# Altium schematic sheet control.SchDoc (part 2 of 2)
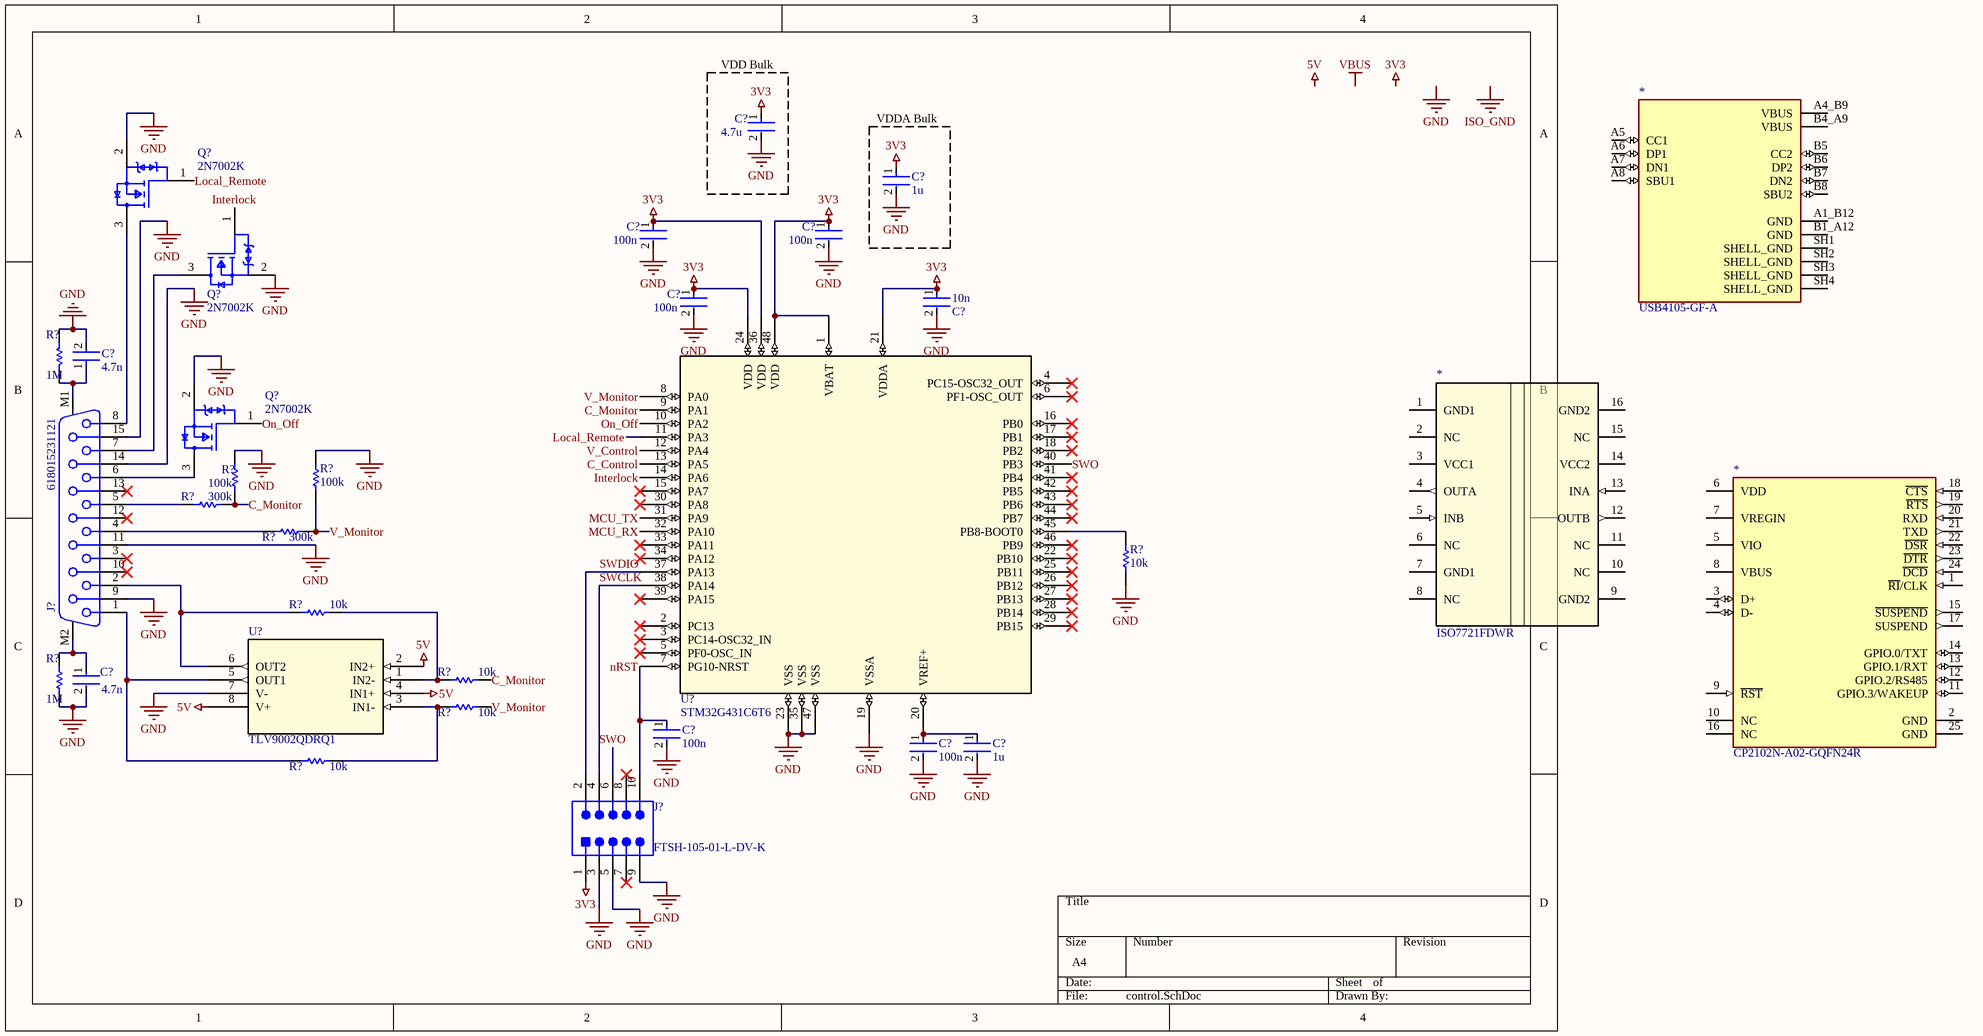
[diagram p1: control.SchDoc]

## Library data of the parts (continued)
Q?#1-Q?#3 = 2N7002K: Mosfet N-ch 60V 300MA SOT23 / Trans Mosfet N-ch 60V 0.3A 3-PIN SOT-23 T/r; Manufacturer: onsemi; Manufacturer Lifecycle Status: ACTIVE; Continuous Drain Current (ID): 115mA; Current: 3A; Drain to Source Resistance: 2Ω; Element Configuration: Single; Gate to Source Voltage (Vgs): 20V; Input Capacitance: 50pF; Max Junction Temperature (Tj): 150°C; Max Power Dissipation: 350W; Number of Channels: 1; Power Dissipation: 300mW; Value: 2Ω; Threshold Voltage: 2.5V; Turn-Off Delay Time: 55.8ns; Turn-On Delay Time: 12.2ns; Supplier: DigiKey; Supplier Part Number: 2N7002KCT-ND; Manufacturer Part Number: 2N7002K; RoHS: Compliant; Category: MOSFETs; Stock: 393574; Pricing: 1=0.33, 10=0.203, 100=0.1271, 500=0.09384, 1000=0.08309 (USD); Case/Package: SOT-23; China RoHS: Compliant; Contact Plating: Tin; Drain to Source Breakdown Voltage: 60V; Drain to Source Voltage (Vdss): 60V; Height: 1.11mm; Lead Free: Lead Free; Length: 2.92mm; Lifecycle Status: Production; Max Operating Temperature: 150°C; Min Breakdown Voltage: 60V; Min Operating Temperature: -55°C; Mounting Technology: Surface Mount; Number of Elements: 1; Pins: 3; Number of Terminals: 3; Radiation Hardening: No; Rds On Max: 2Ω; REACH SVHC: Yes; Schedule B: 8541210080, 8541210080|8541210080|8541210080|8541210080|8541210080; Voltage: 60V; Width: 1.3mm; ComponentLink1URL: https://datasheet.octopart.com:443/2N7002K-onsemi-datasheet-180957336.pdf?src-supplier=IHS; ComponentLink1Description: https://datasheet.octopart.com:443/2N7002K-onsemi-datasheet-180957336.pdf?src-supplier=IHS; ComponentLink2URL: https://datasheet.octopart.com:443/2N7002K-Fairchild-Semiconductor-datasheet-34208596.pdf?src-supplier=IHS; ComponentLink2Description: https://datasheet.octopart.com:443/2N7002K-Fairchild-Semiconductor-datasheet-34208596.pdf?src-supplier=IHS; ComponentLink3URL: https://datasheet.octopart.com:443/2N7002K-ON-Semiconductor-datasheet-138897972.pdf?src-supplier=onsemi; ComponentLink3Description: https://datasheet.octopart.com:443/2N7002K-ON-Semiconductor-datasheet-138897972.pdf?src-supplier=onsemi; ComponentLink4URL: https://datasheet.octopart.com:443/2N7002K-ON-Semiconductor-datasheet-147841327.pdf?src-supplier=onsemi; ComponentLink4Description: https://datasheet.octopart.com:443/2N7002K-ON-Semiconductor-datasheet-147841327.pdf?src-supplier=onsemi; ComponentLink5URL: https://datasheet.octopart.com:443/2N7002K-ON-Semiconductor-datasheet-81464098.pdf?src-supplier=onsemi; ComponentLink5Description: https://datasheet.octopart.com:443/2N7002K-ON-Semiconductor-datasheet-81464098.pdf?src-supplier=onsemi; ComponentLink6URL: https://datasheet.octopart.com:443/2N7002K-ON-Semiconductor-datasheet-8636720.pdf?src-supplier=onsemi; ComponentLink6Description: https://datasheet.octopart.com:443/2N7002K-ON-Semiconductor-datasheet-8636720.pdf?src-supplier=onsemi; ComponentLink7URL: https://sigma.octopart.com:443/138897241/technical_drawing/ON-Semiconductor-2N7002K.pdf?src-supplier=Upverter; ComponentLink7Description: https://sigma.octopart.com:443/138897241/technical_drawing/ON-Semiconductor-2N7002K.pdf?src-supplier=Upverter; ComponentLink8URL: https://datasheet.octopart.com:443/2N7002K-ON-Semiconductor-datasheet-13704821.pdf?src-supplier=element14+APAC; ComponentLink8Description: https://datasheet.octopart.com:443/2N7002K-ON-Semiconductor-datasheet-13704821.pdf?src-supplier=element14+APAC; ComponentLink9URL: https://datasheet.octopart.com:443/2N7002K-ON-Semiconductor-datasheet-86682065.pdf?src-supplier=element14+APAC; ComponentLink9Description: https://datasheet.octopart.com:443/2N7002K-ON-Semiconductor-datasheet-86682065.pdf?src-supplier=element14+APAC; ComponentLink10URL: https://datasheet.octopart.com:443/2N7002K-onsemi-datasheet-181958640.pdf?src-supplier=Newark; ComponentLink10Description: https://datasheet.octopart.com:443/2N7002K-onsemi-datasheet-181958640.pdf?src-supplier=Newark; ComponentLink11URL: https://datasheet.octopart.com:443/2N7002K-Fairchild-Semiconductor-datasheet-67650041.pdf?src-supplier=Newark; ComponentLink11Description: https://datasheet.octopart.com:443/2N7002K-Fairchild-Semiconductor-datasheet-67650041.pdf?src-supplier=Newark; ComponentLink12URL: https://datasheet.octopart.com:443/2N7002K-Fairchild-Semiconductor-datasheet-68365086.pdf?src-supplier=Newark; ComponentLink12Description: https://datasheet.octopart.com:443/2N7002K-Fairchild-Semiconductor-datasheet-68365086.pdf?src-supplier=Newark; ComponentLink13URL: https://datasheet.octopart.com:443/2N7002K-Fairchild-Semiconductor-datasheet-68558619.pdf?src-supplier=Newark; ComponentLink13Description: https://datasheet.octopart.com:443/2N7002K-Fairchild-Semiconductor-datasheet-68558619.pdf?src-supplier=Newark; ComponentLink14URL: https://datasheet.octopart.com:443/2N7002K-ON-Semiconductor-datasheet-137315652.pdf?src-supplier=Future+Electronics; ComponentLink14Description: https://datasheet.octopart.com:443/2N7002K-ON-Semiconductor-datasheet-137315652.pdf?src-supplier=Future+Electronics; ComponentLink15URL: https://sigma.octopart.com:443/17343971/technical_drawing/Fairchild-Semiconductor-2N7002K.pdf?src-supplier=Fairchild+Semiconductor; ComponentLink15Description: https://sigma.octopart.com:443/17343971/technical_drawing/Fairchild-Semiconductor-2N7002K.pdf?src-supplier=Fairchild+Semiconductor; ComponentLink16URL: https://datasheet.octopart.com:443/2N7002K-Fairchild-Semiconductor-datasheet-67878677.pdf?src-supplier=Farnell; ComponentLink16Description: https://datasheet.octopart.com:443/2N7002K-Fairchild-Semiconductor-datasheet-67878677.pdf?src-supplier=Farnell; ComponentLink17URL: https://datasheet.octopart.com:443/2N7002K-Fairchild-Semiconductor-datasheet-68650436.pdf?src-supplier=Farnell; ComponentLink17Description: https://datasheet.octopart.com:443/2N7002K-Fairchild-Semiconductor-datasheet-68650436.pdf?src-supplier=Farnell; ComponentLink18URL: https://datasheet.octopart.com:443/2N7002K-Fairchild-Semiconductor-datasheet-78857226.pdf?src-supplier=Farnell; ComponentLink18Description: https://datasheet.octopart.com:443/2N7002K-Fairchild-Semiconductor-datasheet-78857226.pdf?src-supplier=Farnell; ComponentLink19URL: http://sigma.octopart.com:80/150600003/rohs_statement/ON-Semiconductor-2N7002K.pdf?src-supplier=Compliance+Statements; ComponentLink19Description: http://sigma.octopart.com:80/150600003/rohs_statement/ON-Semiconductor-2N7002K.pdf?src-supplier=Compliance+Statements; ComponentLink20URL: http://sigma.octopart.com:80/17343977/reach_statement/Fairchild-Semiconductor-2N7002K.pdf?src-supplier=Compliance+Statements; ComponentLink20Description: http://sigma.octopart.com:80/17343977/reach_statement/Fairchild-Semiconductor-2N7002K.pdf?src-supplier=Compliance+Statements; ComponentLink21URL: http://sigma.octopart.com:80/17343978/materials_sheet/Fairchild-Semiconductor-2N7002K.pdf?src-supplier=Compliance+Statements; ComponentLink21Description: http://sigma.octopart.com:80/17343978/materials_sheet/Fairchild-Semiconductor-2N7002K.pdf?src-supplier=Compliance+Statements; ComponentLink22URL: http://sigma.octopart.com:80/33036988/materials_sheet/Fairchild-Semiconductor-2N7002K.pdf?src-supplier=Compliance+Statements; ComponentLink22Description: http://sigma.octopart.com:80/33036988/materials_sheet/Fairchild-Semiconductor-2N7002K.pdf?src-supplier=Compliance+Statements; ComponentLink23URL: http://sigma.octopart.com:80/33036987/reach_statement/Fairchild-Semiconductor-2N7002K.pdf?src-supplier=Compliance+Statements; ComponentLink23Description: http://sigma.octopart.com:80/33036987/reach_statement/Fairchild-Semiconductor-2N7002K.pdf?src-supplier=Compliance+Statements; ComponentLink24URL: http://sigma.octopart.com:80/reach_statement/ON-Semiconductor-company-79.pdf?src-supplier=Compliance+Statements; ComponentLink24Description: http://sigma.octopart.com:80/reach_statement/ON-Semiconductor-company-79.pdf?src-supplier=Compliance+Statements; ComponentLink25URL: http://sigma.octopart.com:80/rohs_statement/Fairchild-Semiconductor-company-11.pdf?src-supplier=Compliance+Statements; ComponentLink25Description: http://sigma.octopart.com:80/rohs_statement/Fairchild-Semiconductor-company-11.pdf?src-supplier=Compliance+Statements; ComponentLink26URL: http://sigma.octopart.com:80/rohs_statement/Fairchild-Semiconductor-company-10.pdf?src-supplier=Compliance+Statements; ComponentLink26Description: http://sigma.octopart.com:80/rohs_statement/Fairchild-Semiconductor-company-10.pdf?src-supplier=Compliance+Statements; ComponentLink27URL: http://sigma.octopart.com:80/reach_statement/Fairchild-Semiconductor-company-9.pdf?src-supplier=Compliance+Statements; ComponentLink27Description: http://sigma.octopart.com:80/reach_statement/Fairchild-Semiconductor-company-9.pdf?src-supplier=Compliance+Statements; ComponentLink28URL: https://octopart.com:443/opatz8j6/c1?t=nm5kdMlbaAnwpklrVZblZ0nE71AQlgwh7ERqQoEJhKvEfgRp_9FXj7IMoPPC8V_j13LWXOpO2Jxw4bOkneI3J4oQ-Ueqca9fxYR6kFJosDJCZUuoEPm8PptoZzKZNXIWwYdL1v0f_3jxmMMd6AmYg9Y7R4OLdY3QL6Rk6u6ai-3ss5V1K0SdYAJs7A9F18xCMj7KK3OJ0kjjq8to-n9XtuWqv7DBv7T5vrdVNUg03mJ5ApziGpyAB5Qe7qbvoVw8pQA7F0WEglJk1PRa4-p6s3a5dQiLDUC_bYLpYK_Y4Yhi_XqAGpD62eBhzZC41UC6OOQBzi0Qvg0NEKn45CaGve0MJuREN5MOXiQU&src-supplier=Compliance+Statements; ComponentLink28Description: https://octopart.com:443/opatz8j6/c1?t=nm5kdMlbaAnwpklrVZblZ0nE71AQlgwh7ERqQoEJhKvEfgRp_9FXj7IMoPPC8V_j13LWXOpO2Jxw4bOkneI3J4oQ-Ueqca9fxYR6kFJosDJCZUuoEPm8PptoZzKZNXIWwYdL1v0f_3jxmMMd6AmYg9Y7R4OLdY3QL6Rk6u6ai-3ss5V1K0SdYAJs7A9F18xCMj7KK3OJ0kjjq8to-n9XtuWqv7DBv7T5vrdVNUg03mJ5ApziGpyAB5Qe7qbvoVw8pQA7F0WEglJk1PRa4-p6s3a5dQiLDUC_bYLpYK_Y4Yhi_XqAGpD62eBhzZC41UC6OOQBzi0Qvg0NEKn45CaGve0MJuREN5MOXiQU&src-supplier=Compliance+Statements; ComponentLink29URL: https://octopart.com:443/opatz8j6/c1?t=yP1dprRIHwIgdvtjb9FYqRaP3_9HWgrBaL9JkhjecsSuf0n6cINMsFwp5N6FMygctrzVDOAIh4pqo1B7NhLuP4EfhfgMmii0srxvh2XxIZc2UWh74_aW-dJirl-sIPHhCpS4y3FsLHcYkfI7uz7Zobk3yF8mMTCkQ2uO5Ev9E03_1hZh6X3YtwOYI82JGjIbo8QvUN_FXJ9Womd2nii1m-sUjS3nWbw_QaYVMn5ZbNRqutWyxY-yUPVqm24VyLJbSNi-am4bjCcC6TDsH0hBYj3fGvqNFGx_58D2X5w3EoEA4KlvTi0mcDs5gj__gSGJCxXMmsSQPns7LYMZtqXHHcrx3ZG_xUyLjZk&src-supplier=Compliance+Statements; ComponentLink29Description: https://octopart.com:443/opatz8j6/c1?t=yP1dprRIHwIgdvtjb9FYqRaP3_9HWgrBaL9JkhjecsSuf0n6cINMsFwp5N6FMygctrzVDOAIh4pqo1B7NhLuP4EfhfgMmii0srxvh2XxIZc2UWh74_aW-dJirl-sIPHhCpS4y3FsLHcYkfI7uz7Zobk3yF8mMTCkQ2uO5Ev9E03_1hZh6X3YtwOYI82JGjIbo8QvUN_FXJ9Womd2nii1m-sUjS3nWbw_QaYVMn5ZbNRqutWyxY-yUPVqm24VyLJbSNi-am4bjCcC6TDsH0hBYj3fGvqNFGx_58D2X5w3EoEA4KlvTi0mcDs5gj__gSGJCxXMmsSQPns7LYMZtqXHHcrx3ZG_xUyLjZk&src-supplier=Compliance+Statements; Supplier 1: DigiKey; Supplier Part Number 1: 2N7002KCT-ND
R?#1 R?#9 = RC0603FR-071ML: Res Thick Film 0603 1M Ohm 1% 0.1W(1/10W) ±100ppm/°C Pad SMD T/R / RES SMD 1M OHM 1% 1/10W 0603; Manufacturer: Yageo Group; Value: 1mF; Power Rating: 100mW; Voltage Rating: 25V; Working Voltage: 75V; Supplier: DigiKey; Supplier Part Number: 311-1.00MHRCT-ND; Manufacturer Part Number: RC0603FR-071ML; RoHS: Compliant; Category: Chip SMD Resistors; Stock: 484489; Pricing: 1=0.1, 10=0.025, 25=0.0188, 50=0.015, 100=0.0122, 250=0.0094, 500=0.00782, 1000=0.00661 (USD); Case/Package: 0603; Case Code (Imperial): 0603; Case Code (Metric): 0603; China RoHS: Non-Compliant; Composition: Thick Film; Country of Origin: Mainland China, Taiwan; Depth: 800µm; Diameter: 10mm; Export Control Classification Number (ECCN) Code: EAR99; Height: 450µm; Harmonized Tariff Schedule (HTS) Code: 8533.21.00.30; Introduction Date: 2004-10-04; Lead Free: Lead Free; Lead Pitch: 5mm; Length: 1.6mm; Lifecycle Status: Production; Max Operating Temperature: 155°C; Military Standard: Not; Min Operating Temperature: -55°C; Mounting Technology: Surface Mount; Pins: 2; Number of Terminals: 2; Packaging: Bulk; Radiation Hardening: No; REACH SVHC: Yes; Schedule B: 8533210045, 8533210045|8533210045|8533210045|8533210045|8533210045|8533210045|8533210045|8533210045|8533210045|8533210045|8533210045|8533210045|8533210045|8533210045|8533210045|8533210045|8533210045|8533210045|8533210045|8533210045|8533210045|8533210045|8533210045|85; Temperature Coefficient: 100ppm/°C; Termination: SMD/SMT; Tolerance: 1%; Voltage Rating (DC): 25V; Width: 800µm; ComponentLink1URL: https://datasheet.octopart.com:443/RC0603FR-071ML-Yageo-datasheet-175887523.pdf?src-supplier=Newark; ComponentLink1Description: https://datasheet.octopart.com:443/RC0603FR-071ML-Yageo-datasheet-175887523.pdf?src-supplier=Newark; ComponentLink2URL: https://datasheet.octopart.com:443/RC0603FR-071ML-Yageo-datasheet-34211833.pdf?src-supplier=Newark; ComponentLink2Description: https://datasheet.octopart.com:443/RC0603FR-071ML-Yageo-datasheet-34211833.pdf?src-supplier=Newark; ComponentLink3URL: https://datasheet.octopart.com:443/RC0603FR-071ML-Yageo-datasheet-8328172.pdf?src-supplier=element14+APAC; ComponentLink3Description: https://datasheet.octopart.com:443/RC0603FR-071ML-Yageo-datasheet-8328172.pdf?src-supplier=element14+APAC; ComponentLink4URL: https://datasheet.octopart.com:443/RC0603FR-071ML-Yageo-datasheet-17842380.pdf?src-supplier=element14+APAC; ComponentLink4Description: https://datasheet.octopart.com:443/RC0603FR-071ML-Yageo-datasheet-17842380.pdf?src-supplier=element14+APAC; ComponentLink5URL: https://datasheet.octopart.com:443/RC0603FR-071ML-Yageo-datasheet-62067350.pdf?src-supplier=Farnell; ComponentLink5Description: https://datasheet.octopart.com:443/RC0603FR-071ML-Yageo-datasheet-62067350.pdf?src-supplier=Farnell; ComponentLink6URL: https://datasheet.octopart.com:443/RC0603FR-071ML-Yageo-datasheet-13691069.pdf?src-supplier=Farnell; ComponentLink6Description: https://datasheet.octopart.com:443/RC0603FR-071ML-Yageo-datasheet-13691069.pdf?src-supplier=Farnell; ComponentLink7URL: https://datasheet.octopart.com:443/RC0603FR-071ML-Yageo-datasheet-103092701.pdf?src-supplier=Upverter; ComponentLink7Description: https://datasheet.octopart.com:443/RC0603FR-071ML-Yageo-datasheet-103092701.pdf?src-supplier=Upverter; ComponentLink8URL: https://datasheet.octopart.com:443/RC0603FR-071ML-Yageo-datasheet-79472498.pdf?src-supplier=Upverter; ComponentLink8Description: https://datasheet.octopart.com:443/RC0603FR-071ML-Yageo-datasheet-79472498.pdf?src-supplier=Upverter; ComponentLink9URL: https://datasheet.octopart.com:443/RC0603FR-071ML-Yageo-Group-datasheet-176638170.pdf?src-supplier=Future+Electronics; ComponentLink9Description: https://datasheet.octopart.com:443/RC0603FR-071ML-Yageo-Group-datasheet-176638170.pdf?src-supplier=Future+Electronics; ComponentLink10URL: https://datasheet.octopart.com:443/RC0603FR-071ML-Yageo-datasheet-164759695.pdf?src-supplier=Future+Electronics; ComponentLink10Description: https://datasheet.octopart.com:443/RC0603FR-071ML-Yageo-datasheet-164759695.pdf?src-supplier=Future+Electronics; ComponentLink11URL: https://datasheet.octopart.com:443/RC0603FR-071ML-Yageo-datasheet-137700087.pdf?src-supplier=Future+Electronics; ComponentLink11Description: https://datasheet.octopart.com:443/RC0603FR-071ML-Yageo-datasheet-137700087.pdf?src-supplier=Future+Electronics; ComponentLink12URL: https://datasheet.octopart.com:443/RC0603FR-071ML-Yageo-datasheet-27584510.pdf?src-supplier=Future+Electronics; ComponentLink12Description: https://datasheet.octopart.com:443/RC0603FR-071ML-Yageo-datasheet-27584510.pdf?src-supplier=Future+Electronics; ComponentLink13URL: https://datasheet.octopart.com:443/RC0603FR-071ML-Yageo-datasheet-15599030.pdf?src-supplier=Future+Electronics; ComponentLink13Description: https://datasheet.octopart.com:443/RC0603FR-071ML-Yageo-datasheet-15599030.pdf?src-supplier=Future+Electronics; ComponentLink14URL: https://datasheet.octopart.com:443/RC0603FR-071ML-Yageo-datasheet-12596169.pdf?src-supplier=Future+Electronics; ComponentLink14Description: https://datasheet.octopart.com:443/RC0603FR-071ML-Yageo-datasheet-12596169.pdf?src-supplier=Future+Electronics; ComponentLink15URL: https://datasheet.octopart.com:443/RC0603FR-071ML-Yageo-datasheet-8324193.pdf?src-supplier=Future+Electronics; ComponentLink15Description: https://datasheet.octopart.com:443/RC0603FR-071ML-Yageo-datasheet-8324193.pdf?src-supplier=Future+Electronics; ComponentLink16URL: https://datasheet.octopart.com/RC0603FR-071ML-Yageo-datasheet-73766026.pdf; ComponentLink16Description: https://datasheet.octopart.com/RC0603FR-071ML-Yageo-datasheet-73766026.pdf; ComponentLink17URL: https://datasheet.octopart.com:443/RC0603FR-071ML-Yageo-datasheet-30459151.pdf?src-supplier=Seeed+Studio; ComponentLink17Description: https://datasheet.octopart.com:443/RC0603FR-071ML-Yageo-datasheet-30459151.pdf?src-supplier=Seeed+Studio; ComponentLink18URL: https://datasheet.octopart.com:443/RC0603FR-071ML-Yageo-datasheet-118562.pdf?src-supplier=DigiKey; ComponentLink18Description: https://datasheet.octopart.com:443/RC0603FR-071ML-Yageo-datasheet-118562.pdf?src-supplier=DigiKey; ComponentLink19URL: https://datasheet.octopart.com:443/RC0603FR-071ML-Yageo-datasheet-503470.pdf?src-supplier=element14; ComponentLink19Description: https://datasheet.octopart.com:443/RC0603FR-071ML-Yageo-datasheet-503470.pdf?src-supplier=element14; ComponentLink20URL: http://sigma.octopart.com:80/conflict_mineral_statement/Yageo-company-3.pdf?src-supplier=Compliance+Statements; ComponentLink20Description: http://sigma.octopart.com:80/conflict_mineral_statement/Yageo-company-3.pdf?src-supplier=Compliance+Statements; ComponentLink21URL: http://sigma.octopart.com:80/rohs_statement/Yageo-company-2.pdf?src-supplier=Compliance+Statements; ComponentLink21Description: http://sigma.octopart.com:80/rohs_statement/Yageo-company-2.pdf?src-supplier=Compliance+Statements; Supplier 1: DigiKey; Supplier Part Number 1: 311-1.00MHRCT-ND
R?#2 R?#4 = RC0805FR-07100KL: 125Mw Thick Film Resistors 100Ppm/ 1% 100K 0805 Chip Resistor Surface Mount Rohs; Manufacturer: Yageo Group; Value: 100kΩ; Temperature Coefficient: 100ppm/°C; Voltage Rating: 150V; Supplier: DigiKey; Supplier Part Number: 311-100KCRCT-ND; Manufacturer Part Number: RC0805FR-07100KL; RoHS: Compliant; Category: Chip SMD Resistors; Stock: 586431; Pricing: 1=0.1, 10=0.034, 25=0.0256, 50=0.0208, 100=0.0171, 250=0.01344, 500=0.01136, 1000=0.00973 (USD); Case/Package: 0805; Case Code (Imperial): 0805; China RoHS: Non-Compliant; Composition: Thick Film; Contact Plating: Tin; Country of Origin: Mainland China, Taiwan; Depth: 1.25mm; Export Control Classification Number (ECCN) Code: EAR99; Features: Moisture Resistant; Height: 500µm; Harmonized Tariff Schedule (HTS) Code: 8533.21.00.30; Introduction Date: 2004-09-22; Lead Free: Lead Free; Lead Pitch: 400µm; Length: 2mm; Lifecycle Status: Production; Max Operating Temperature: 155°C; Max Power Dissipation: 125mW; Military Standard: Not; Min Operating Temperature: -55°C; Mounting Technology: Surface Mount; Pins: 2; Number of Terminals: 2; Number of Terminations: 2; Packaging: Tape & Reel; Power Rating: 125mW; Radiation Hardening: No; REACH SVHC: Yes; Schedule B: 8533210045, 8533210045|8533210045, 8533210045|8533210045|8533210045, 8533210045|8533210045|8533210045|8533210045; Termination: SMD/SMT; Tolerance: 1%; Voltage Rating (AC): 150V; Voltage Rating (DC): 150V; Width: 1.25mm; Working Voltage: 150V; ComponentLink1URL: https://datasheet.octopart.com:443/RC0805FR-07100KL-Yageo-datasheet-175887523.pdf?src-supplier=Newark; ComponentLink1Description: https://datasheet.octopart.com:443/RC0805FR-07100KL-Yageo-datasheet-175887523.pdf?src-supplier=Newark; ComponentLink2URL: https://datasheet.octopart.com:443/RC0805FR-07100KL-Yageo-datasheet-164759695.pdf?src-supplier=Upverter; ComponentLink2Description: https://datasheet.octopart.com:443/RC0805FR-07100KL-Yageo-datasheet-164759695.pdf?src-supplier=Upverter; ComponentLink3URL: https://datasheet.octopart.com:443/RC0805FR-07100KL-Yageo-datasheet-103092701.pdf?src-supplier=Upverter; ComponentLink3Description: https://datasheet.octopart.com:443/RC0805FR-07100KL-Yageo-datasheet-103092701.pdf?src-supplier=Upverter; ComponentLink4URL: https://sigma.octopart.com:443/138820526/technical_drawing/Yageo-RC0805FR-07100KL.pdf?src-supplier=Upverter; ComponentLink4Description: https://sigma.octopart.com:443/138820526/technical_drawing/Yageo-RC0805FR-07100KL.pdf?src-supplier=Upverter; ComponentLink5URL: https://datasheet.octopart.com:443/RC0805FR-07100KL-Yageo-datasheet-118657.pdf?src-supplier=DigiKey; ComponentLink5Description: https://datasheet.octopart.com:443/RC0805FR-07100KL-Yageo-datasheet-118657.pdf?src-supplier=DigiKey; ComponentLink6URL: https://datasheet.octopart.com:443/RC0805FR-07100KL-Yageo-datasheet-8330313.pdf?src-supplier=element14+APAC; ComponentLink6Description: https://datasheet.octopart.com:443/RC0805FR-07100KL-Yageo-datasheet-8330313.pdf?src-supplier=element14+APAC; ComponentLink7URL: https://datasheet.octopart.com:443/RC0805FR-07100KL-Yageo-datasheet-12592811.pdf?src-supplier=element14+APAC; ComponentLink7Description: https://datasheet.octopart.com:443/RC0805FR-07100KL-Yageo-datasheet-12592811.pdf?src-supplier=element14+APAC; ComponentLink8URL: https://datasheet.octopart.com:443/RC0805FR-07100KL-Yageo-Group-datasheet-190305687.pdf?src-supplier=Future+Electronics; ComponentLink8Description: https://datasheet.octopart.com:443/RC0805FR-07100KL-Yageo-Group-datasheet-190305687.pdf?src-supplier=Future+Electronics; ComponentLink9URL: https://datasheet.octopart.com:443/RC0805FR-07100KL-Yageo-datasheet-127823281.pdf?src-supplier=Future+Electronics; ComponentLink9Description: https://datasheet.octopart.com:443/RC0805FR-07100KL-Yageo-datasheet-127823281.pdf?src-supplier=Future+Electronics; ComponentLink10URL: https://datasheet.octopart.com:443/RC0805FR-07100KL-Yageo-datasheet-137700087.pdf?src-supplier=Future+Electronics; ComponentLink10Description: https://datasheet.octopart.com:443/RC0805FR-07100KL-Yageo-datasheet-137700087.pdf?src-supplier=Future+Electronics; ComponentLink11URL: https://datasheet.octopart.com:443/RC0805FR-07100KL-Yageo-datasheet-77992522.pdf?src-supplier=Future+Electronics; ComponentLink11Description: https://datasheet.octopart.com:443/RC0805FR-07100KL-Yageo-datasheet-77992522.pdf?src-supplier=Future+Electronics; ComponentLink12URL: https://datasheet.octopart.com:443/RC0805FR-07100KL-Yageo-datasheet-80324437.pdf?src-supplier=Future+Electronics; ComponentLink12Description: https://datasheet.octopart.com:443/RC0805FR-07100KL-Yageo-datasheet-80324437.pdf?src-supplier=Future+Electronics; ComponentLink13URL: https://datasheet.octopart.com:443/RC0805FR-07100KL-Yageo-datasheet-67302840.pdf?src-supplier=Future+Electronics; ComponentLink13Description: https://datasheet.octopart.com:443/RC0805FR-07100KL-Yageo-datasheet-67302840.pdf?src-supplier=Future+Electronics; ComponentLink14URL: https://datasheet.octopart.com:443/RC0805FR-07100KL-Yageo-datasheet-8324252.pdf?src-supplier=Future+Electronics; ComponentLink14Description: https://datasheet.octopart.com:443/RC0805FR-07100KL-Yageo-datasheet-8324252.pdf?src-supplier=Future+Electronics; ComponentLink15URL: https://datasheet.octopart.com:443/RC0805FR-07100KL-Yageo-datasheet-62067350.pdf?src-supplier=Farnell; ComponentLink15Description: https://datasheet.octopart.com:443/RC0805FR-07100KL-Yageo-datasheet-62067350.pdf?src-supplier=Farnell; ComponentLink16URL: https://datasheet.octopart.com:443/RC0805FR-07100KL-Yageo-datasheet-13691069.pdf?src-supplier=Farnell; ComponentLink16Description: https://datasheet.octopart.com:443/RC0805FR-07100KL-Yageo-datasheet-13691069.pdf?src-supplier=Farnell; ComponentLink17URL: https://datasheet.octopart.com:443/RC0805FR-07100KL-Yageo-datasheet-79472498.pdf?src-supplier=Megastar; ComponentLink17Description: https://datasheet.octopart.com:443/RC0805FR-07100KL-Yageo-datasheet-79472498.pdf?src-supplier=Megastar; ComponentLink18URL: https://datasheet.octopart.com:443/RC0805FR-07100KL-Yageo-datasheet-27714392.pdf?src-supplier=Seeed+Studio; ComponentLink18Description: https://datasheet.octopart.com:443/RC0805FR-07100KL-Yageo-datasheet-27714392.pdf?src-supplier=Seeed+Studio; ComponentLink19URL: https://datasheet.octopart.com/RC0805FR-07100KL-Yageo-datasheet-73766026.pdf; ComponentLink19Description: https://datasheet.octopart.com/RC0805FR-07100KL-Yageo-datasheet-73766026.pdf; ComponentLink20URL: https://datasheet.octopart.com:443/RC0805FR-07100KL-Yageo-datasheet-502840.pdf?src-supplier=element14; ComponentLink20Description: https://datasheet.octopart.com:443/RC0805FR-07100KL-Yageo-datasheet-502840.pdf?src-supplier=element14; ComponentLink21URL: http://sigma.octopart.com:80/conflict_mineral_statement/Yageo-company-3.pdf?src-supplier=Compliance+Statements; ComponentLink21Description: http://sigma.octopart.com:80/conflict_mineral_statement/Yageo-company-3.pdf?src-supplier=Compliance+Statements; ComponentLink22URL: http://sigma.octopart.com:80/rohs_statement/Yageo-company-2.pdf?src-supplier=Compliance+Statements; ComponentLink22Description: http://sigma.octopart.com:80/rohs_statement/Yageo-company-2.pdf?src-supplier=Compliance+Statements; Supplier 1: DigiKey; Supplier Part Number 1: 311-100KCRCT-ND
R?#3 R?#5 = RC0805FR-07300KL: Res Thick Film 0805 300K Ohm 1% 0.125W(1/8W) ±100ppm/C Pad SMD T/R; Manufacturer: Yageo Group; Manufacturer Package Identifier: 0805 (2012 metric); Power Rating: 125mW; Value: 300kΩ; Temperature Coefficient: 100ppm/°C; Voltage Rating: 150V; Supplier: DigiKey; Supplier Part Number: 311-300KCRCT-ND; Manufacturer Part Number: RC0805FR-07300KL; RoHS: Compliant; Category: Chip SMD Resistors; Stock: 34073; Pricing: 1=0.1, 10=0.034, 25=0.0256, 50=0.0208, 100=0.0171, 250=0.01344, 500=0.01136, 1000=0.00973 (USD); Case/Package: 0805; Case Code (Imperial): 0805; China RoHS: Non-Compliant; Composition: Thick Film; Depth: 1.25mm; Height: 500µm; Lead Free: Lead Free; Length: 2mm; Lifecycle Status: Production; Max Operating Temperature: 155°C; Min Operating Temperature: -55°C; Mounting Technology: Surface Mount; Number of Terminals: 2; Packaging: Tape & Reel; REACH SVHC: Yes; Schedule B: 8533210045, 8533210045|8533210045, 8533210045|8533210045|8533210045, 8533210045|8533210045|8533210045|8533210045; Termination: SMD/SMT; Tolerance: 1%; Voltage Rating (DC): 150V; Weight: 5.499807mg; Width: 1.25mm; Working Voltage: 150V; ComponentLink1URL: https://datasheet.octopart.com:443/RC0805FR-07300KL-Yageo-datasheet-175887523.pdf?src-supplier=IHS; ComponentLink1Description: https://datasheet.octopart.com:443/RC0805FR-07300KL-Yageo-datasheet-175887523.pdf?src-supplier=IHS; ComponentLink2URL: https://datasheet.octopart.com:443/RC0805FR-07300KL-Yageo-datasheet-103092701.pdf?src-supplier=Upverter; ComponentLink2Description: https://datasheet.octopart.com:443/RC0805FR-07300KL-Yageo-datasheet-103092701.pdf?src-supplier=Upverter; ComponentLink3URL: https://datasheet.octopart.com:443/RC0805FR-07300KL-Yageo-datasheet-8330313.pdf?src-supplier=TME; ComponentLink3Description: https://datasheet.octopart.com:443/RC0805FR-07300KL-Yageo-datasheet-8330313.pdf?src-supplier=TME; ComponentLink4URL: https://datasheet.octopart.com:443/RC0805FR-07300KL-Yageo-Group-datasheet-176638170.pdf?src-supplier=Future+Electronics; ComponentLink4Description: https://datasheet.octopart.com:443/RC0805FR-07300KL-Yageo-Group-datasheet-176638170.pdf?src-supplier=Future+Electronics; ComponentLink5URL: https://datasheet.octopart.com:443/RC0805FR-07300KL-Yageo-datasheet-164759695.pdf?src-supplier=Future+Electronics; ComponentLink5Description: https://datasheet.octopart.com:443/RC0805FR-07300KL-Yageo-datasheet-164759695.pdf?src-supplier=Future+Electronics; ComponentLink6URL: https://datasheet.octopart.com:443/RC0805FR-07300KL-Yageo-datasheet-127823281.pdf?src-supplier=Future+Electronics; ComponentLink6Description: https://datasheet.octopart.com:443/RC0805FR-07300KL-Yageo-datasheet-127823281.pdf?src-supplier=Future+Electronics; ComponentLink7URL: https://datasheet.octopart.com:443/RC0805FR-07300KL-Yageo-datasheet-137700087.pdf?src-supplier=Future+Electronics; ComponentLink7Description: https://datasheet.octopart.com:443/RC0805FR-07300KL-Yageo-datasheet-137700087.pdf?src-supplier=Future+Electronics; ComponentLink8URL: https://datasheet.octopart.com:443/RC0805FR-07300KL-Yageo-datasheet-12592811.pdf?src-supplier=Future+Electronics; ComponentLink8Description: https://datasheet.octopart.com:443/RC0805FR-07300KL-Yageo-datasheet-12592811.pdf?src-supplier=Future+Electronics; ComponentLink9URL: https://datasheet.octopart.com:443/RC0805FR-07300KL-Yageo-datasheet-8324252.pdf?src-supplier=Future+Electronics; ComponentLink9Description: https://datasheet.octopart.com:443/RC0805FR-07300KL-Yageo-datasheet-8324252.pdf?src-supplier=Future+Electronics; ComponentLink10URL: https://datasheet.octopart.com/RC0805FR-07300KL-Yageo-datasheet-73766026.pdf; ComponentLink10Description: https://datasheet.octopart.com/RC0805FR-07300KL-Yageo-datasheet-73766026.pdf; ComponentLink11URL: https://datasheet.octopart.com:443/RC0805FR-07300KL-Yageo-datasheet-118657.pdf?src-supplier=DigiKey; ComponentLink11Description: https://datasheet.octopart.com:443/RC0805FR-07300KL-Yageo-datasheet-118657.pdf?src-supplier=DigiKey; ComponentLink12URL: http://sigma.octopart.com:80/conflict_mineral_statement/Yageo-company-3.pdf?src-supplier=Compliance+Statements; ComponentLink12Description: http://sigma.octopart.com:80/conflict_mineral_statement/Yageo-company-3.pdf?src-supplier=Compliance+Statements; ComponentLink13URL: http://sigma.octopart.com:80/rohs_statement/Yageo-company-2.pdf?src-supplier=Compliance+Statements; ComponentLink13Description: http://sigma.octopart.com:80/rohs_statement/Yageo-company-2.pdf?src-supplier=Compliance+Statements; Supplier 1: DigiKey; Supplier Part Number 1: 311-300KCRCT-ND
R?#6-R?#8 R?#10 R?#11 = RC0805FR-0710KL: Res General Purpose Thick Film 0805 10k Ohm 1% 1/8W ±100ppm/°C Ceramic Paper T/R; Manufacturer: Yageo Group; Max Power Dissipation: 125mW; Value: 10kΩ; Voltage Rating: 150V; Supplier: DigiKey; Supplier Part Number: 311-10.0KCRCT-ND; Manufacturer Part Number: RC0805FR-0710KL; RoHS: Compliant; Category: Chip SMD Resistors; Stock: 4083661; Pricing: 1=0.1, 10=0.034, 25=0.0256, 50=0.0208, 100=0.0171, 250=0.01344, 500=0.01136, 1000=0.00973 (USD); Case/Package: 0805; Case Code (Imperial): 0805; China RoHS: Non-Compliant; Composition: Thick Film; Contact Plating: Tin; Country of Origin: Mainland China, Taiwan; Depth: 1.25mm; Export Control Classification Number (ECCN) Code: EAR99; Features: Moisture Resistant; Height: 500µm; Harmonized Tariff Schedule (HTS) Code: 8533.21.00.30; Introduction Date: 2004-09-22; Lead Free: Lead Free; Length: 2mm; Lifecycle Status: Production; Max Operating Temperature: 155°C; Military Standard: Not; Min Operating Temperature: -55°C; Mounting Technology: Surface Mount; Pins: 2; Number of Terminals: 2; Number of Terminations: 2; Packaging: Tape and Reel; Power Rating: 125mW; Radiation Hardening: No; REACH SVHC: Yes; Schedule B: 8533210045, 8533210045|8533210045|8533210045|8533210045|8533210045|8533210045|8533210045|8533210045|8533210045|8533210045|8533210045|8533210045|8533210045|8533210045|8533210045|8533210045|8533210045|8533210045|8533210045|8533210045|8533210045|8533210045|8533210045|85; Temperature Coefficient: 100ppm/°C; Termination: SMD/SMT; Tolerance: 1%; Voltage Rating (AC): 150V; Voltage Rating (DC): 150V; Width: 1.25mm; Working Voltage: 150V; ComponentLink1URL: https://datasheet.octopart.com:443/RC0805FR-0710KL-Yageo-datasheet-175887523.pdf?src-supplier=Newark; ComponentLink1Description: https://datasheet.octopart.com:443/RC0805FR-0710KL-Yageo-datasheet-175887523.pdf?src-supplier=Newark; ComponentLink2URL: https://datasheet.octopart.com:443/RC0805FR-0710KL-Yageo-datasheet-62067350.pdf?src-supplier=Farnell; ComponentLink2Description: https://datasheet.octopart.com:443/RC0805FR-0710KL-Yageo-datasheet-62067350.pdf?src-supplier=Farnell; ComponentLink3URL: https://datasheet.octopart.com:443/RC0805FR-0710KL-Yageo-datasheet-13691069.pdf?src-supplier=Farnell; ComponentLink3Description: https://datasheet.octopart.com:443/RC0805FR-0710KL-Yageo-datasheet-13691069.pdf?src-supplier=Farnell; ComponentLink4URL: https://datasheet.octopart.com:443/RC0805FR-0710KL-Yageo-datasheet-103092701.pdf?src-supplier=Upverter; ComponentLink4Description: https://datasheet.octopart.com:443/RC0805FR-0710KL-Yageo-datasheet-103092701.pdf?src-supplier=Upverter; ComponentLink5URL: https://datasheet.octopart.com:443/RC0805FR-0710KL-Yageo-datasheet-98239111.pdf?src-supplier=Upverter; ComponentLink5Description: https://datasheet.octopart.com:443/RC0805FR-0710KL-Yageo-datasheet-98239111.pdf?src-supplier=Upverter; ComponentLink6URL: https://datasheet.octopart.com:443/RC0805FR-0710KL-Yageo---Phycomp-datasheet-67302840.pdf?src-supplier=Upverter; ComponentLink6Description: https://datasheet.octopart.com:443/RC0805FR-0710KL-Yageo---Phycomp-datasheet-67302840.pdf?src-supplier=Upverter; ComponentLink7URL: https://datasheet.octopart.com:443/RC0805FR-0710KL-Yageo-datasheet-8330313.pdf?src-supplier=element14+APAC; ComponentLink7Description: https://datasheet.octopart.com:443/RC0805FR-0710KL-Yageo-datasheet-8330313.pdf?src-supplier=element14+APAC; ComponentLink8URL: https://datasheet.octopart.com:443/RC0805FR-0710KL-Yageo-datasheet-12592811.pdf?src-supplier=element14+APAC; ComponentLink8Description: https://datasheet.octopart.com:443/RC0805FR-0710KL-Yageo-datasheet-12592811.pdf?src-supplier=element14+APAC; ComponentLink9URL: https://datasheet.octopart.com:443/RC0805FR-0710KL-Yageo-Group-datasheet-190305687.pdf?src-supplier=Future+Electronics; ComponentLink9Description: https://datasheet.octopart.com:443/RC0805FR-0710KL-Yageo-Group-datasheet-190305687.pdf?src-supplier=Future+Electronics; ComponentLink10URL: https://datasheet.octopart.com:443/RC0805FR-0710KL-Yageo-datasheet-164759695.pdf?src-supplier=Future+Electronics; ComponentLink10Description: https://datasheet.octopart.com:443/RC0805FR-0710KL-Yageo-datasheet-164759695.pdf?src-supplier=Future+Electronics; ComponentLink11URL: https://datasheet.octopart.com:443/RC0805FR-0710KL-Yageo-datasheet-15800360.pdf?src-supplier=Future+Electronics; ComponentLink11Description: https://datasheet.octopart.com:443/RC0805FR-0710KL-Yageo-datasheet-15800360.pdf?src-supplier=Future+Electronics; ComponentLink12URL: https://datasheet.octopart.com:443/RC0805FR-0710KL-Yageo-datasheet-8324252.pdf?src-supplier=Future+Electronics; ComponentLink12Description: https://datasheet.octopart.com:443/RC0805FR-0710KL-Yageo-datasheet-8324252.pdf?src-supplier=Future+Electronics; ComponentLink13URL: https://datasheet.octopart.com:443/RC0805FR-0710KL-Yageo-datasheet-79472498.pdf?src-supplier=Megastar; ComponentLink13Description: https://datasheet.octopart.com:443/RC0805FR-0710KL-Yageo-datasheet-79472498.pdf?src-supplier=Megastar; ComponentLink14URL: https://datasheet.octopart.com:443/RC0805FR-0710KL-Yageo-datasheet-27714392.pdf?src-supplier=Seeed+Studio; ComponentLink14Description: https://datasheet.octopart.com:443/RC0805FR-0710KL-Yageo-datasheet-27714392.pdf?src-supplier=Seeed+Studio; ComponentLink15URL: https://datasheet.octopart.com/RC0805FR-0710KL-Yageo-datasheet-73766026.pdf; ComponentLink15Description: https://datasheet.octopart.com/RC0805FR-0710KL-Yageo-datasheet-73766026.pdf; ComponentLink16URL: https://datasheet.octopart.com:443/RC0805FR-0710KL-Yageo-datasheet-118657.pdf?src-supplier=DigiKey; ComponentLink16Description: https://datasheet.octopart.com:443/RC0805FR-0710KL-Yageo-datasheet-118657.pdf?src-supplier=DigiKey; ComponentLink17URL: https://datasheet.octopart.com:443/RC0805FR-0710KL-Yageo-datasheet-502840.pdf?src-supplier=element14; ComponentLink17Description: https://datasheet.octopart.com:443/RC0805FR-0710KL-Yageo-datasheet-502840.pdf?src-supplier=element14; ComponentLink18URL: http://sigma.octopart.com:80/conflict_mineral_statement/Yageo-company-3.pdf?src-supplier=Compliance+Statements; ComponentLink18Description: http://sigma.octopart.com:80/conflict_mineral_statement/Yageo-company-3.pdf?src-supplier=Compliance+Statements; ComponentLink19URL: http://sigma.octopart.com:80/rohs_statement/Yageo-company-2.pdf?src-supplier=Compliance+Statements; ComponentLink19Description: http://sigma.octopart.com:80/rohs_statement/Yageo-company-2.pdf?src-supplier=Compliance+Statements; Supplier 1: DigiKey; Supplier Part Number 1: 311-10.0KCRCT-ND
U?#1 = STM32G431C6T6: Microcontroller 32-Bit ARM Cortex-M4 RISC 32K-Byte Flash 3.3V 48-Pin LQFP; Manufacturer: STMicroelectronics; ADC Channels (Resolution): 17-Ch 12-Bit; DAC Channels (Resolution): 4-Ch 12-Bit; EEPROM Memory Size: 0B; Flash Memory Size: 32kB; Frequency: 170MHz; Interface: USB; Clock Frequency: 48MHz; Max Supply Current: 29mA; Max Supply Voltage: 3.6V; Min Supply Voltage: 1.71V; Nominal Supply Voltage (DC): 3V; Number of A/D Converters: 2; Number of Channels: 17; Number of I2C Channels: 3; Number of I/Os: 5; Number of Interrupts: 16; Number of Timers/Counters: 12; Peripherals: POR; Supplier: DigiKey; Supplier Part Number: STM32G431C6T6-ND; Manufacturer Part Number: STM32G431C6T6; RoHS: Compliant; Category: Microcontrollers; Stock: 1643; Pricing: 1=4.96, 10=3.769, 25=3.4728, 100=3.1467, 250=2.99128, 500=2.8976, 1500=2.78186, 3000=2.72522 (USD); Case/Package: LFQFP; China RoHS: Compliant; Core Architecture: ARM Cortex-M4; Country of Origin: Mainland China, Taiwan; Export Control Classification Number (ECCN) Code: 3A991.A.2; Height - Seated (Max): 1.6mm; Harmonized Tariff Schedule (HTS) Code: 8542.31.00.25; Introduction Date: 2019-10-29; Length: 7mm; Lifecycle Status: Production; Max Operating Temperature: 85°C; Memory Format: FLASH; Min Operating Temperature: -40°C; Number of D/A Converters: 2; Number of SPI Channels: 3; Number of Terminals: 48; Number of USART Channels: 3; RAM Size: 32kB; REACH SVHC: Yes; Schedule B: 8542310000, 8542310000|8542310000|8542310000|8542310000|8542310000; Terminal Pitch: 500µm; Width: 7mm; ComponentLink1URL: https://datasheet.octopart.com:443/STM32G431C6T6-STMicroelectronics-datasheet-159144895.pdf?src-supplier=Newark; ComponentLink1Description: https://datasheet.octopart.com:443/STM32G431C6T6-STMicroelectronics-datasheet-159144895.pdf?src-supplier=Newark; ComponentLink2URL: https://datasheet.octopart.com:443/STM32G431C6T6-STMicroelectronics-datasheet-144618855.pdf?src-supplier=TME; ComponentLink2Description: https://datasheet.octopart.com:443/STM32G431C6T6-STMicroelectronics-datasheet-144618855.pdf?src-supplier=TME; Supplier 1: DigiKey; Supplier Part Number 1: STM32G431C6T6-ND
U?#2 = TLV9002QDRQ1: IC OPAMP GP 2 CIRCUIT 8SOIC / General Purpose Amplifier 2 Circuit Rail-to-Rail 8-SOIC; Manufacturer: Texas Instruments; Manufacturer Lifecycle Status: ACTIVE; Number of Channels: 2; Supplier: DigiKey; Supplier Part Number: 296-TLV9002QDRQ1CT-ND; Manufacturer Part Number: TLV9002QDRQ1; RoHS: Compliant; Category: Amplifiers - Op Amps, Buffer, Instrumentation; Stock: 6623; Pricing: 1=0.85, 10=0.605, 25=0.5448, 100=0.4781, 250=0.44628, 500=0.42712, 1000=0.41157 (USD); Case/Package: SOIC; Height: 1.75mm; Length: 4.9mm; Lifecycle Status: Production; Pins: 8; Thickness: 1.58mm; Width: 3.91mm; ComponentLink1URL: https://octopart.com:443/opatz8j6/c1?t=qNF0SmTfBXis5KuBjHu_0Lw95Gt-ppfX15eU3m0_OURFg7j8CzT1s6WowRPHsWIZbws3EfKsRzYBH_TRpeCcHToL-R8J8UZv9V6Wb1InHiIF8k8Y35NGcowJXJUYI1pnD5fADJ0R8GDNKVUWtLRHCqAGovzBPeiRsuxY5ipn9AhUhRmeYe6-OEpKfd42lu5pCk4HkhVEFD2Mur4YXRhcDV4Iflc8CkCZrl32D2A_m-0JnDbSslzSoAr2XFTf6lypRU0dY9KGNUak8fQ6OqAy5KWwSyRqBFS9rqoF33jhrK8rQgwd-x-Rf5GN-l31P0z1b0gEpQmPDdC7yH2zrnDiFm3LW_bWGcyYXUOocwlnj5ahD-Q0gTJopkT0i_QUuv2BzVg-w33TaJf5&src-supplier=Texas+Instruments; ComponentLink1Description: https://octopart.com:443/opatz8j6/c1?t=qNF0SmTfBXis5KuBjHu_0Lw95Gt-ppfX15eU3m0_OURFg7j8CzT1s6WowRPHsWIZbws3EfKsRzYBH_TRpeCcHToL-R8J8UZv9V6Wb1InHiIF8k8Y35NGcowJXJUYI1pnD5fADJ0R8GDNKVUWtLRHCqAGovzBPeiRsuxY5ipn9AhUhRmeYe6-OEpKfd42lu5pCk4HkhVEFD2Mur4YXRhcDV4Iflc8CkCZrl32D2A_m-0JnDbSslzSoAr2XFTf6lypRU0dY9KGNUak8fQ6OqAy5KWwSyRqBFS9rqoF33jhrK8rQgwd-x-Rf5GN-l31P0z1b0gEpQmPDdC7yH2zrnDiFm3LW_bWGcyYXUOocwlnj5ahD-Q0gTJopkT0i_QUuv2BzVg-w33TaJf5&src-supplier=Texas+Instruments; ComponentLink2URL: https://datasheet.octopart.com:443/TLV9002QDRQ1-Texas-Instruments-datasheet-164419143.pdf?src-supplier=Augswan; ComponentLink2Description: https://datasheet.octopart.com:443/TLV9002QDRQ1-Texas-Instruments-datasheet-164419143.pdf?src-supplier=Augswan; ComponentLink3URL: http://sigma.octopart.com:80/reach_statement/Texas-Instruments-company-64.pdf?src-supplier=Compliance+Statements; ComponentLink3Description: http://sigma.octopart.com:80/reach_statement/Texas-Instruments-company-64.pdf?src-supplier=Compliance+Statements; ComponentLink4URL: http://sigma.octopart.com:80/conflict_mineral_statement/Texas-Instruments-company-63.pdf?src-supplier=Compliance+Statements; ComponentLink4Description: http://sigma.octopart.com:80/conflict_mineral_statement/Texas-Instruments-company-63.pdf?src-supplier=Compliance+Statements; Supplier 1: DigiKey; Supplier Part Number 1: 296-TLV9002QDRQ1CT-ND